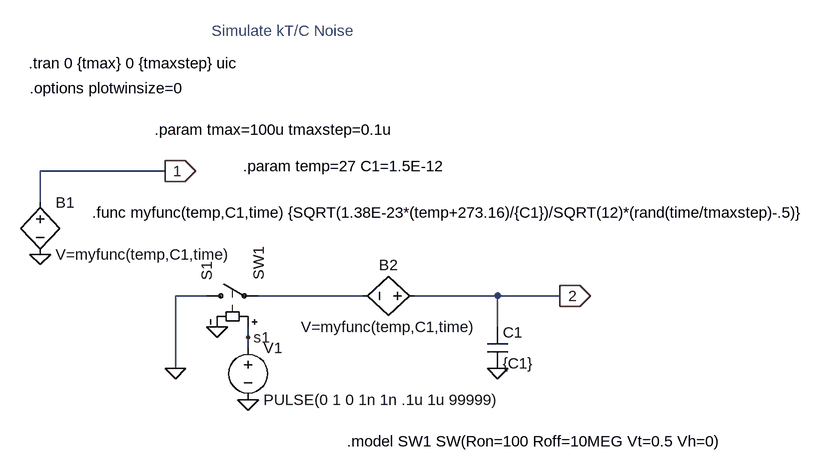
[diagram p0: schematic kT_C_noise.asc]
kT_C_noise.asc, the LTspice schematic file:
Version 4
SHEET 1 1324 680
WIRE 0 208 0 160
WIRE 192 160 0 160
WIRE 208 464 208 352
WIRE 256 352 208 352
WIRE 320 416 320 400
WIRE 320 432 320 416
WIRE 496 352 336 352
WIRE 704 352 576 352
WIRE 704 400 704 352
WIRE 800 352 704 352
FLAG 0 288 0
FLAG 192 160 1
IOPIN 192 160 Out
FLAG 320 512 0
FLAG 800 352 2
IOPIN 800 352 Out
FLAG 704 464 0
FLAG 208 464 0
FLAG 272 400 0
FLAG 320 416 s1
SYMBOL bv 0 192 R0
SYMATTR InstName B1
SYMATTR Value V=myfunc(temp,C1,time)
SYMBOL voltage 320 416 R0
WINDOW 123 0 0 Left 0
WINDOW 39 0 0 Left 0
SYMATTR InstName V1
SYMATTR Value PULSE(0 1 0 1n 1n .1u 1u 99999)
SYMBOL bv 592 352 R90
WINDOW 0 -32 56 VBottom 0
WINDOW 3 32 56 VTop 0
SYMATTR InstName B2
SYMATTR Value V=myfunc(temp,C1,time)
SYMBOL cap 688 400 R0
SYMATTR InstName C1
SYMATTR Value {C1}
SYMBOL sw 240 352 R270
SYMATTR InstName S1
SYMATTR Value SW1
TEXT 176 96 Left 0 !.param tmax=100u tmaxstep=0.1u
TEXT -18 -6 Left 0 !.tran 0 {tmax} 0 {tmaxstep} uic
TEXT -16 32 Left 0 !.options plotwinsize=0
TEXT 80 224 Left 0 !.func myfunc(temp,C1,time) {SQRT(1.38E-23*(temp+273.16)/{C1})/SQRT(12)*(rand(time/tmaxstep)-.5)}
TEXT 312 152 Left 0 !.param temp=27 C1=1.5E-12
TEXT 264 -56 Left 0 ;Simulate kT/C Noise
TEXT 472 576 Left 0 !.model SW1 SW(Ron=100 Roff=10MEG Vt=0.5 Vh=0)

The netlist it stands for:
* kT_C_noise.asc
B1 1 0 V=myfunc(temp,C1,time)
V1 s1 0 PULSE(0 1 0 1n 1n .1u 1u 99999)
B2 2 N001 V=myfunc(temp,C1,time)
C1 2 0 {C1}
S1 0 N001 s1 0 SW1
.param tmax=100u tmaxstep=0.1u
.tran 0 {tmax} 0 {tmaxstep} uic
.options plotwinsize=0
.func myfunc(temp,C1,time) {SQRT(1.38E-23*(temp+273.16)/{C1})/SQRT(12)*(rand(time/tmaxstep)-.5)}
.param temp=27 C1=1.5E-12
* Simulate kT/C Noise
.model SW1 SW(Ron=100 Roff=10MEG Vt=0.5 Vh=0)
.backanno
.end